# EAGLE design uINS_Mk1 (EAGLE 8.3.1)
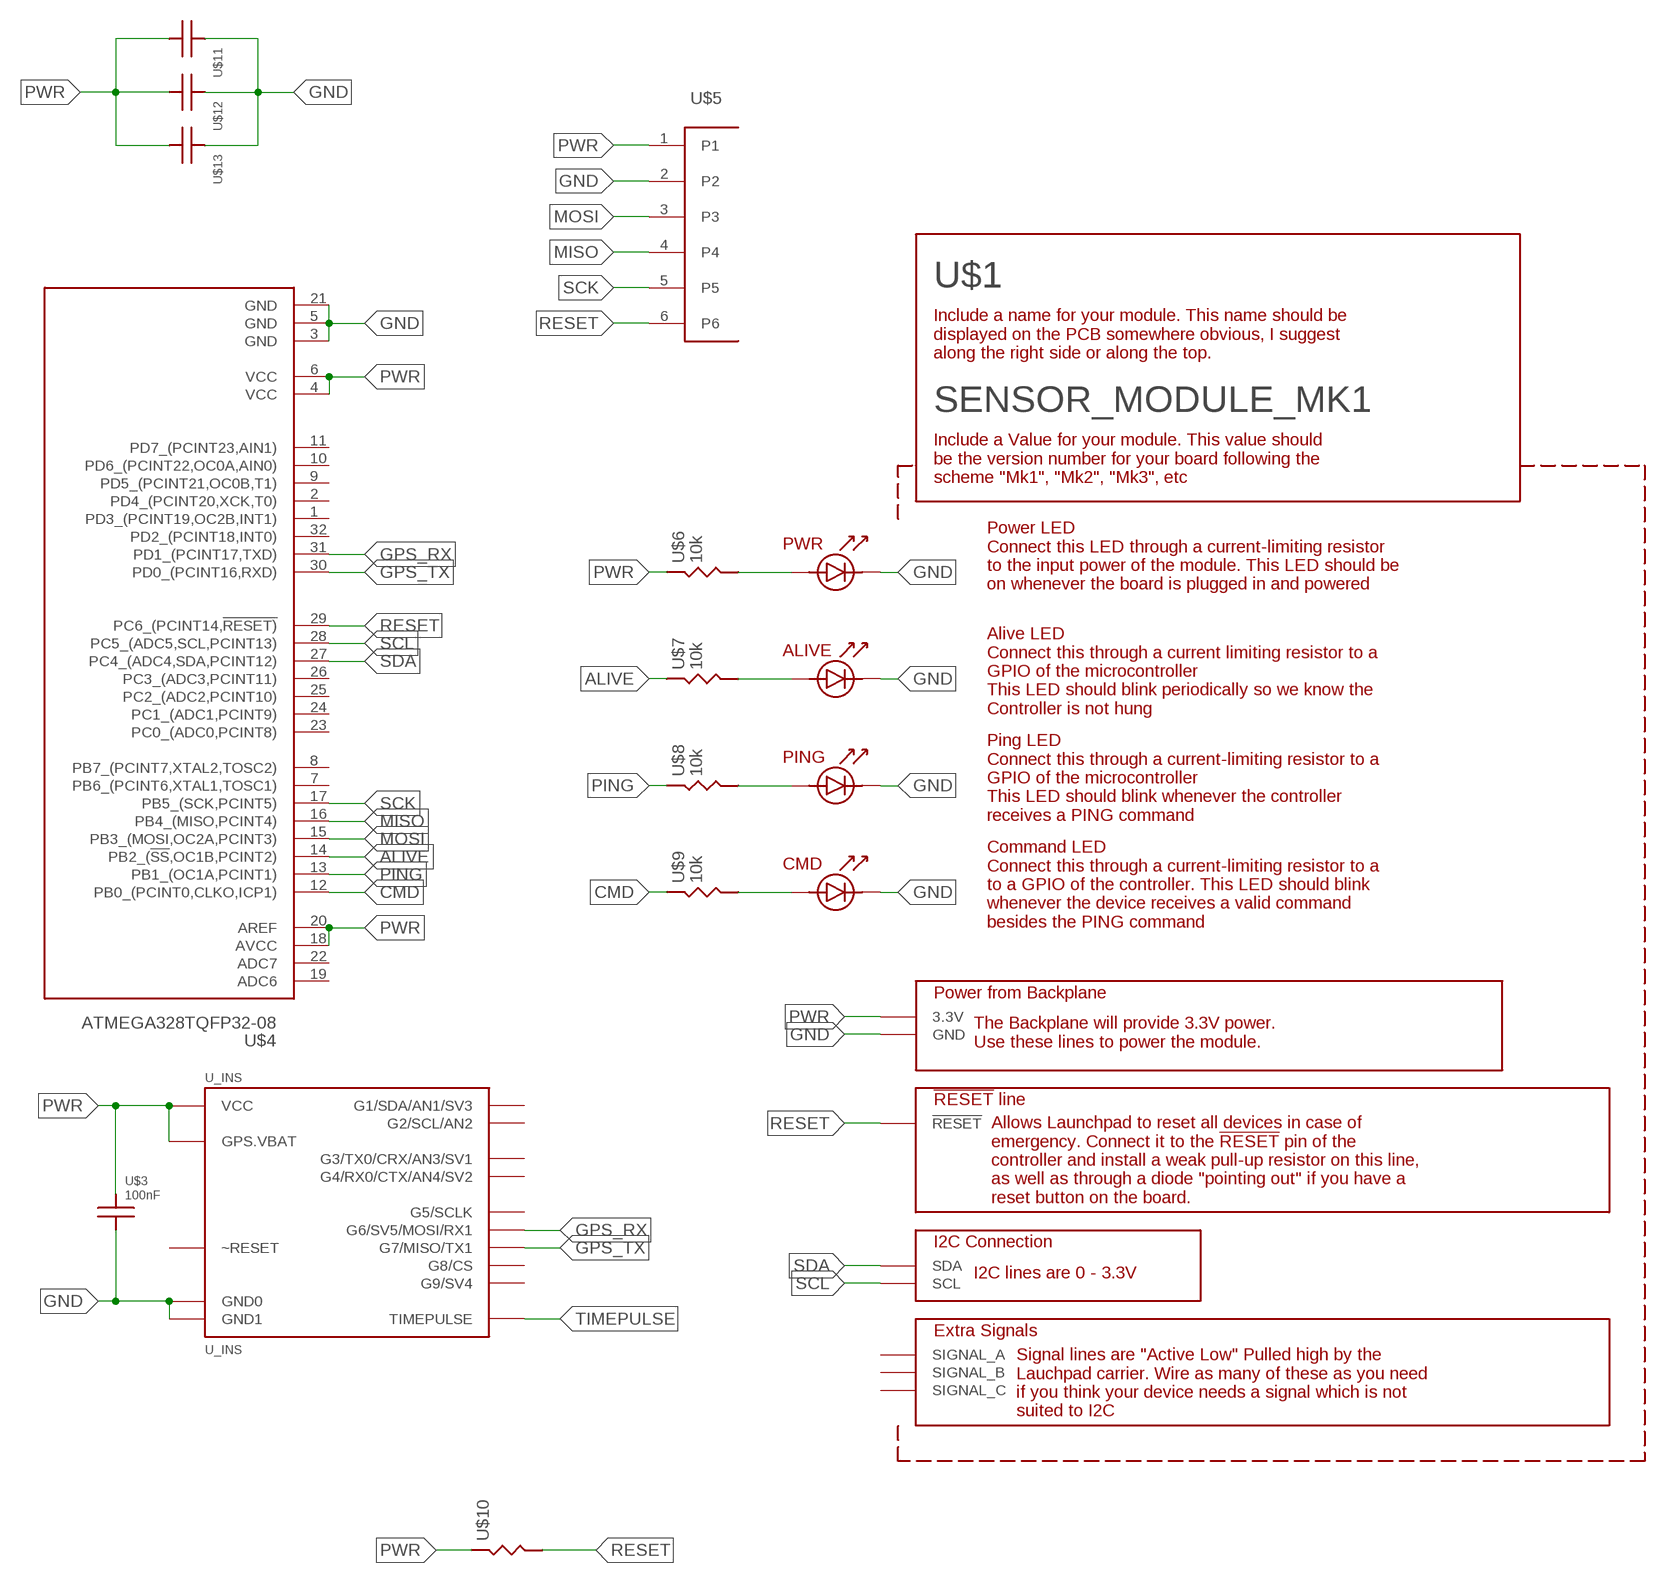
[diagram p0: schematic, sheet 1]

## Parts
U$1  SENSOR_MODULE_MK1  [SENSOR_MODULE_MK1]
U$3  100nF  CAPACITOR-UNPOLARIZED0805  [0805_STACKPOLERESISTOR]
U$4  ATMEGA328TQFP32-08  [TQFP32-08]
U$5  6PIN-HEADER2X3  [6PINHEADER_CORRECT]
U$6  10k  RESISTOR  [0805_STACKPOLERESISTOR]
U$7  10k  RESISTOR  [0805_STACKPOLERESISTOR]
U$8  10k  RESISTOR  [0805_STACKPOLERESISTOR]
U$9  10k  RESISTOR  [0805_STACKPOLERESISTOR]
U$10  RESISTOR  [0805_STACKPOLERESISTOR]
U$11  CAPACITOR-UNPOLARIZED0805  [0805_STACKPOLERESISTOR]
U$12  CAPACITOR-UNPOLARIZED0805  [0805_STACKPOLERESISTOR]
U$13  CAPACITOR-UNPOLARIZED0805  [0805_STACKPOLERESISTOR]
U_INS  U_INS  [U_INS]

## Nets
ALIVE: U$4.14(PB2_(!SS,OC1B,PCINT2)) U$7.P$1
CMD: U$4.12(PB0_(PCINT0,CLKO,ICP1)) U$9.P$1
GND: U$1.ALIVELED_CATHODE U$1.CMDLED_CATHODE U$1.GND U$1.PINGLED_CATHODE U$1.PWRLED_CATHODE U$3.P$2 U$4.3(GND) U$4.5(GND) U$4.21(GND) U$5.2 U$11.P$1 U$12.P$1 U$13.P$1 U_INS.GND0 U_INS.GND1
GPS_RX: U$4.31(PD1_(PCINT17,TXD)) U_INS.G6/RX1/MOSI(G6/SV5/MOSI/RX1)
GPS_TX: U$4.30(PD0_(PCINT16,RXD)) U_INS.G7/TX1/MISO(G7/MISO/TX1)
MISO: U$4.16(PB4_(MISO,PCINT4)) U$5.4
MOSI: U$4.15(PB3_(MOSI,OC2A,PCINT3)) U$5.3
N$3: U$1.PWRLED_ANODE U$6.P$2
N$4: U$1.ALIVELED_ANODE U$7.P$2
N$7: U$1.PINGLED_ANODE U$8.P$2
N$8: U$1.CMDLED_ANODE U$9.P$2
PING: U$4.13(PB1_(OC1A,PCINT1)) U$8.P$1
PWR: U$1.3P3V(3.3V) U$3.P$1 U$4.4(VCC) U$4.6(VCC) U$4.18(AVCC) U$4.20(AREF) U$5.1 U$6.P$1 U$10.P$1 U$11.P$2 U$12.P$2 U$13.P$2 U_INS.GPS.VBAT U_INS.VCC
RESET: U$1.RESET(!RESET) U$4.29(PC6_(PCINT14,!RESET)) U$5.6 U$10.P$2
SCK: U$4.17(PB5_(SCK,PCINT5)) U$5.5
SCL: U$1.SCL U$4.28(PC5_(ADC5,SCL,PCINT13))
SDA: U$1.SDA U$4.27(PC4_(ADC4,SDA,PCINT12))
TIMEPULSE: U_INS.GPS.TIMEPULSE(TIMEPULSE)
Unconnected: U$1.A(SIGNAL_A) U$1.B(SIGNAL_B) U$1.C(SIGNAL_C) U$4.1(PD3_(PCINT19,OC2B,INT1)) U$4.2(PD4_(PCINT20,XCK,T0)) U$4.7(PB6_(PCINT6,XTAL1,TOSC1)) U$4.8(PB7_(PCINT7,XTAL2,TOSC2)) U$4.9(PD5_(PCINT21,OC0B,T1)) U$4.10(PD6_(PCINT22,OC0A,AIN0)) U$4.11(PD7_(PCINT23,AIN1)) U$4.19(ADC6) U$4.22(ADC7) U$4.23(PC0_(ADC0,PCINT8)) U$4.24(PC1_(ADC1,PCINT9)) U$4.25(PC2_(ADC2,PCINT10)) U$4.26(PC3_(ADC3,PCINT11)) U$4.32(PD2_(PCINT18,INT0)) U_INS.G1/SDA/AN1(G1/SDA/AN1/SV3) U_INS.G2/SCL/AN2 U_INS.G3/TX0/AN3(G3/TX0/CRX/AN3/SV1) U_INS.G4/RX0/AN4(G4/RX0/CTX/AN4/SV2) U_INS.G5/SCLK U_INS.G8/CS U_INS.G9(G9/SV4) U_INS.N.RESET(~RESET)

## Library data of the parts
U$1 = 000_CustomPartsMaster:SENSOR_MODULE_MK1
U$3 U$11-U$13 = 000_CustomPartsMaster:CAPACITOR-UNPOLARIZED
U$4 = 000_CustomPartsMaster:ATMEGA328
U$5 = 000_CustomPartsMaster:6PIN-HEADER
U$6-U$10 = 000_CustomPartsMaster:RESISTOR
U_INS = 000_CustomPartsMaster:U_INS

## Board
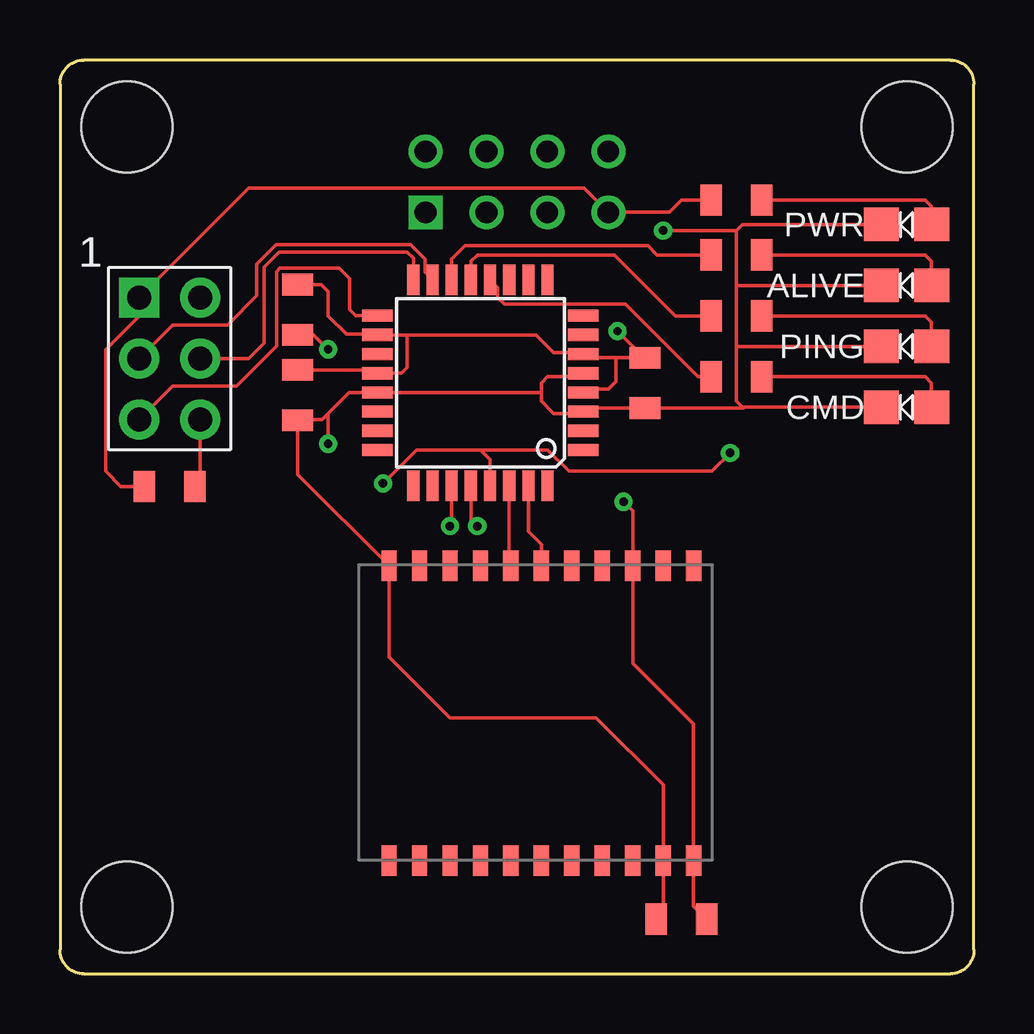
[diagram p1: board, top side]
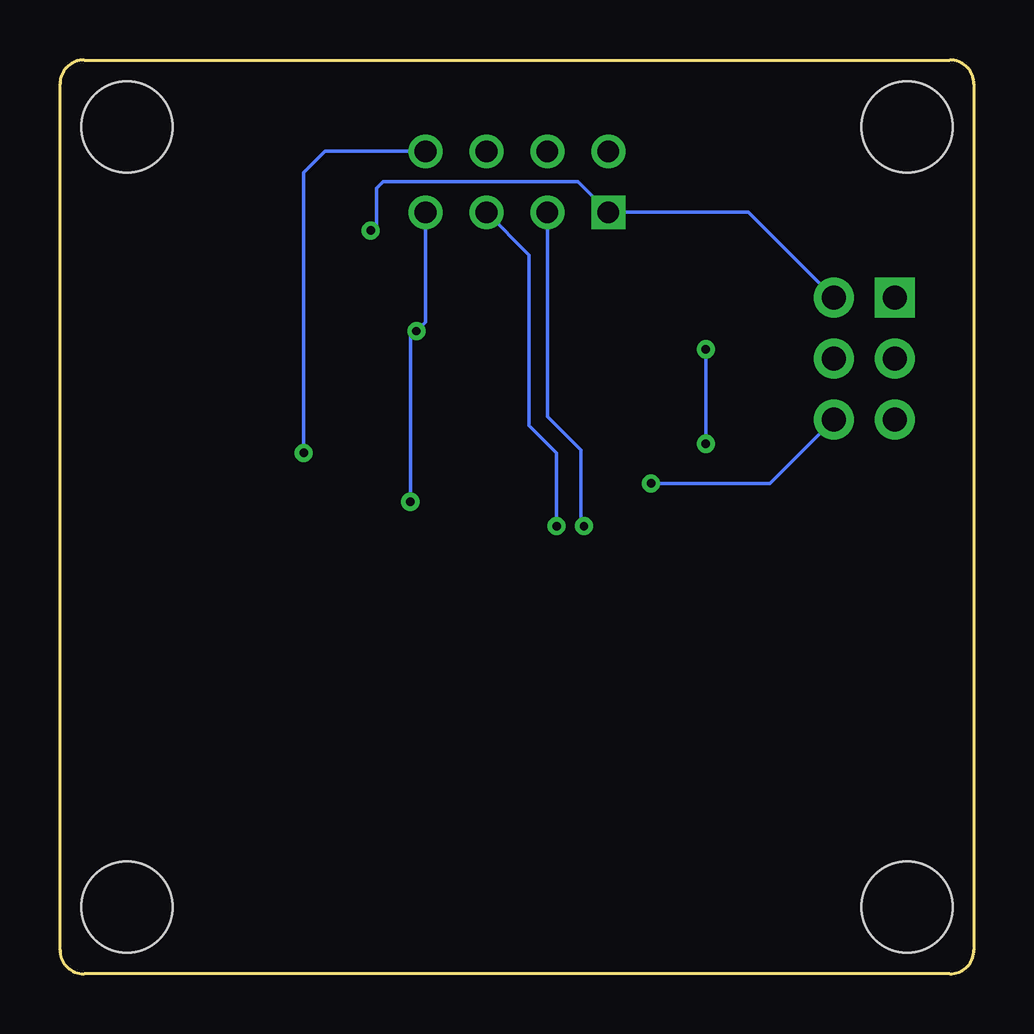
[diagram p2: board, bottom side, seen from below]

Size 38.1 x 38.1 mm. Coordinates in mm from the lower left corner, seen from the top.
Copper layers (1*16): Top 0.035mm / dielectric 1.5mm / Bottom 0.035mm
Design rules "default": minimum track width 6mil, minimum drill 0.35mm, track to track 6mil, track to pad 6mil, pad to pad 6mil, via to via 6mil, smd to smd 6mil, copper to edge 40mil, drill to drill 6mil, minimum pad ring 10mil, minimum via ring 8mil, stop-mask expansion 4mil, vias tented up to drill 0mil, thermal gap 10mil

### Footprints (pad centres in the part's own frame; a part is rotated, then mirrored left to right if it is on the bottom)
SENSOR_MODULE_MK1 = drill 0.9: 3P3V 22.86,31.75; A 20.32,34.29; B 17.78,34.29; C 15.24,34.29; RESET 22.86,34.29; SCL 20.32,31.75; SDA 17.78,31.75 | smd 1.45 x 1.4: ALIVELED_ANODE 36.343,28.702; ALIVELED_CATHODE 34.243,28.702; CMDLED_ANODE 36.343,23.622; CMDLED_CATHODE 34.243,23.622; PINGLED_ANODE 36.343,26.162; PINGLED_CATHODE 34.243,26.162; PWRLED_ANODE 36.343,31.242; PWRLED_CATHODE 34.243,31.242 | drill 0.9 square: GND 15.24,31.75 | hole 3.797: 2.794,2.794; 35.306,2.794; 2.794,35.306; 35.306,35.306
0805_STACKPOLERESISTOR = smd 0.9 x 1.3: P$1 -1.05,0; P$2 1.05,0
TQFP32-08 = smd 1.27 x 0.508: 1 -4.293,2.8; 2 -4.293,2; 3 -4.293,1.2; 4 -4.293,0.4; 5 -4.293,-0.4; 6 -4.293,-1.2; 7 -4.293,-2; 8 -4.293,-2.8; 17 4.293,-2.8; 18 4.293,-2; 19 4.293,-1.2; 20 4.293,-0.4; 21 4.293,0.4; 22 4.293,1.2; 23 4.293,2; 24 4.293,2.8 | smd 0.508 x 1.27: 9 -2.8,-4.293; 10 -2,-4.293; 11 -1.2,-4.293; 12 -0.4,-4.293; 13 0.4,-4.293; 14 1.2,-4.293; 15 2,-4.293; 16 2.8,-4.293; 25 2.8,4.293; 26 2,4.293; 27 1.2,4.293; 28 0.4,4.293; 29 -0.4,4.293; 30 -1.2,4.293; 31 -2,4.293; 32 -2.8,4.293
6PINHEADER_CORRECT = drill 1 pad 1.676 square: 1 0,0 | drill 1 pad 1.676: 2 2.54,0; 3 0,-2.54; 4 2.54,-2.54; 5 0,-5.08; 6 2.54,-5.08
U_INS = smd 1.27 x 0.635: G1/SDA/AN1 1.27,10.16; G2/SCL/AN2 1.27,8.89; G3/TX0/AN3 13.57,10.16; G4/RX0/AN4 13.57,8.89; G5/SCLK 1.27,3.81; G6/RX1/MOSI 1.27,7.62; G7/TX1/MISO 1.27,6.35; G8/CS 1.27,5.08; G9 1.27,2.54; GND0 13.57,12.7; GND1 1.27,1.27; GPS.TIMEPULSE 13.57,11.43; GPS.VBAT 1.27,11.43; N.RESET 13.57,1.27; P$10 1.27,12.7; P$11 1.27,13.97; P$13 13.57,2.54; P$14 13.57,3.81; P$15 13.57,5.08; P$16 13.57,6.35; P$17 13.57,7.62; VCC 13.57,13.97

### Placement (x,y rotation side)
U$1  0,0 0 top
U$3  9.91,24.13 270 top
U$4  17.53,24.64 180 top
U$5  3.3,28.19 0 top
U$6  28.19,32.26 0 top
U$7  28.19,29.97 0 top
U$8  28.19,27.43 0 top
U$9  28.19,24.89 0 top
U$10  4.57,20.32 0 top
U$11  9.91,27.69 90 top
U$12  24.38,24.64 90 top
U$13  25.91,2.29 0 top
U_INS  12.45,18.29 270 top

### Tracks (layer width: path | path; a pad name or v marks a point on that pad's centre or on a via)
ALIVE
  Top 0.152: U$4.14 16.33,29.79 16.89,30.35 24.51,30.35 24.89,29.97 U$7.P$1
CMD
  Top 0.152: U$4.12 18.24,28.61 18.24,28.2 18.52,27.92 23.57,27.92 26.6,24.89 U$9.P$1
GND  (via drill 0.35)
  Top 0.152: U$4.5 21.67,24.89 20.32,24.89 20.07,24.64 20.07,24.17 | 20.07,24.17 20.07,23.88 20.57,23.37 21.75,23.37 arc90 U$4.3 21.97,23.59 U$12.P$1 28.48,23.59 28.52,23.62 | 11.19,23.39 12.05,24.24 U$4.21 20,24.24 20.07,24.17 | 11.19,23.39 10.92,23.11 9.94,23.11 U$3.P$2 9.91,20.83 U_INS.GND1 13.72,13.21 16.26,10.67 22.35,10.67 25.15,7.87 U_INS.GND0 25.15,2.57 U$13.P$1 | 28.52,23.62 U$1.CMDLED_CATHODE | 28.52,23.62 28.45,23.62 28.19,23.88 28.19,26.21 | 28.19,26.21 28.19,28.71 | 28.19,30.92 28.19,28.71 | 28.19,30.92 28.19,30.99 28.45,31.24 U$1.PWRLED_CATHODE | U$1.ALIVELED_CATHODE 28.2,28.7 28.19,28.71 | U$1.PINGLED_CATHODE 28.24,26.16 28.19,26.21 | v25.15,30.99 28.13,30.99 28.19,30.92 | U$11.P$1 10.57,26.64 v11.18,26.04 | v11.18,22.1 11.18,23.37 11.19,23.39
  Bottom 0.152: v25.15,30.99 24.89,31.24 24.89,32.77 24.64,33.02 16.51,33.02 U$1.GND 9.4,31.75 U$5.2 | v11.18,26.04 v11.18,22.1
GPS_RX
  Top 0.152: U$4.31 19.53,18.45 20.07,17.91 U_INS.G6/RX1/MOSI
GPS_TX
  Top 0.152: U_INS.G7/TX1/MISO 18.73,17.09 U$4.30
MISO
  Top 0.152: U$4.16 14.73,29.84 14.48,30.1 9.14,30.1 8.51,29.46 8.51,26.29 7.87,25.65 U$5.4
MOSI
  Top 0.152: U$4.15 15.21,29.25 15.21,29.8 14.6,30.4 9.02,30.4 8.2,29.59 8.2,28.27 6.99,27.05 4.7,27.05 U$5.3
N$3
  Top 0.152: U$6.P$2 36.07,32.26 36.32,32 36.32,31.26 U$1.PWRLED_ANODE
N$4
  Top 0.152: U$7.P$2 36.07,29.97 36.32,29.72 36.32,28.72 U$1.ALIVELED_ANODE
N$7
  Top 0.152: U$8.P$2 36.07,27.43 36.32,27.18 36.32,26.18 U$1.PINGLED_ANODE
N$8
  Top 0.152: U$9.P$2 36.07,24.89 36.32,24.64 36.32,23.64 U$1.CMDLED_ANODE
PING
  Top 0.152: U$8.P$1 25.65,27.43 23.11,29.97 17.4,29.97 17.14,29.72 17.14,28.95 U$4.13
PWR  (via drill 0.35)
  Top 0.152: U$11.P$2 10.89,28.74 11.18,28.45 11.18,27.43 11.94,26.67 13.2,26.67 U$4.18 14.52,26.64 | 23.17,25.69 21.97,25.69 U$4.6 21.75,25.91 20.57,25.91 19.84,26.64 14.52,26.64 | 23.17,25.69 U$12.P$2 24.35,25.69 v23.24,26.8 | U$4.4 21.96,24.38 22.86,24.38 23.17,24.7 23.17,25.69 | U$6.P$1 25.91,32.26 25.4,31.75 U$1.3P3V 21.84,32.77 7.87,32.77 U$5.1 3.3,27.43 1.91,26.04 1.91,20.95 2.54,20.32 U$10.P$1 | U$13.P$2 26.42,2.83 U_INS.VCC 26.42,10.41 23.88,12.95 U_INS.GPS.VBAT 23.88,19.3 v23.5,19.68 | 14.52,26.64 14.48,26.6 14.48,25.27 14.24,25.04 U$4.20 13.09,25.18 U$3.P$1
  Bottom 0.152: U$1.3P3V 22.86,27.18 v23.24,26.8 23.5,26.54 v23.5,19.68
RESET  (via drill 0.35)
  Top 0.152: U$5.6 5.84,20.54 U$10.P$2 | U$4.29 17.93,21.44 17.53,21.84 | 17.53,21.84 14.86,21.84 v13.46,20.45 | 17.53,21.84 20.32,21.84 21.21,20.95 27.18,20.95 v27.94,21.72
  Bottom 0.152: v13.46,20.45 8.51,20.45 U$5.6 | v27.94,21.72 27.94,33.4 27.05,34.29 U$1.RESET
SCK
  Top 0.152: U$4.17 12.31,27.44 12.06,27.69 12.06,28.98 11.63,29.41 9.16,29.41 9.03,29.28 9.03,26.17 7.37,24.51 4.7,24.51 U$5.5
SCL  (via drill 0.35)
  Top 0.152: v17.4,18.67 17.13,18.94 U$4.28
  Bottom 0.152: U$1.SCL 18.54,29.97 18.54,22.86 17.4,21.72 v17.4,18.67
SDA  (via drill 0.35)
  Top 0.152: v16.26,18.67 16.33,18.74 U$4.27
  Bottom 0.152: U$1.SDA 17.78,23.24 16.38,21.84 16.38,18.8 v16.26,18.67